# EAGLE design pendulum_connector_board (EAGLE 9.6.2)
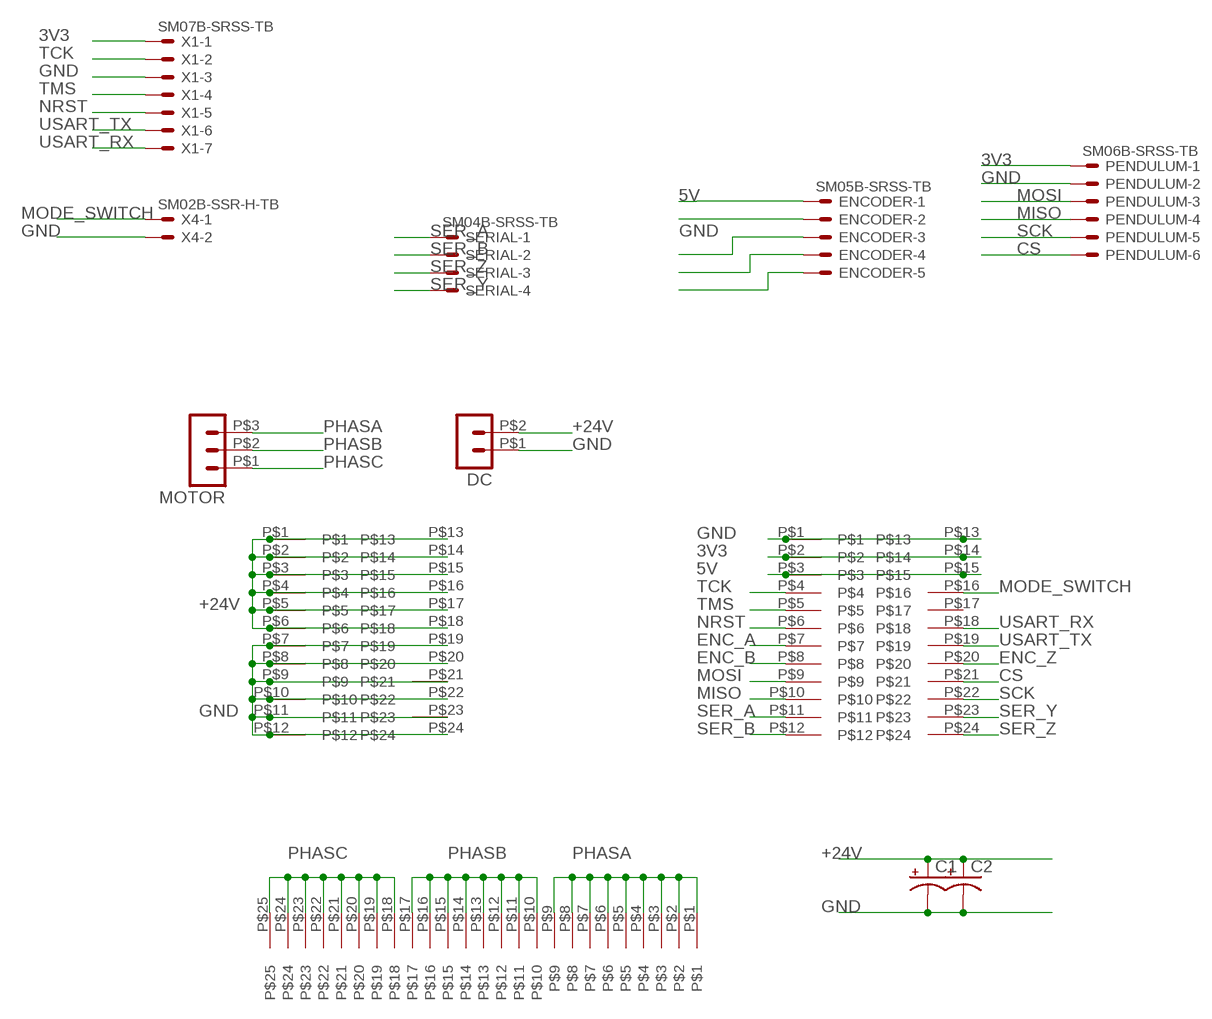
[diagram p0: schematic, sheet 1]

## Parts
C1  CPOL-USE2.5-6  [E2,5-6]
C2  CPOL-USE2.5-6  [E2,5-6]
DC  HEADER_POS2_43650-0200  [43650-0200]
ENCODER  SM05B-SRSS-TB  [SM05B-SRSS-TB]
MOTOR  HEADER_POS3_43650-0300  [43650-0300]
PENDULUM  SM06B-SRSS-TB  [SM06B-SRSS-TB]
SERIAL  SM04B-SRSS-TB  [SM04B-SRSS-TB]
U$2  HEADER_2X12  [2X12X.05]
U$4  HEADER_1X25  [1X25X.05]
U$5  HEADER_2X12  [2X12X.05]
X1  SM07B-SRSS-TB  [SM07B-SRSS-TB]
X4  SM02B-SSR-H-TB  [SM02B-SSR-H-TB]

## Nets
3V3: PENDULUM.1 U$2.P$2 U$2.P$14 X1.1
5V: ENCODER.1 U$2.P$3 U$2.P$15
+24V: C1.+ C2.+ DC.P$2 U$5.P$1 U$5.P$2 U$5.P$3 U$5.P$4 U$5.P$5 U$5.P$6 U$5.P$13 U$5.P$14 U$5.P$15 U$5.P$16 U$5.P$17 U$5.P$18
CS: PENDULUM.6 U$2.P$21
ENC_A: ENCODER.3 U$2.P$7
ENC_B: ENCODER.4 U$2.P$8
ENC_Z: ENCODER.5 U$2.P$20
GND: C1.- C2.- DC.P$1 ENCODER.2 PENDULUM.2 U$2.P$1 U$2.P$13 U$5.P$7 U$5.P$8 U$5.P$9 U$5.P$10 U$5.P$11 U$5.P$12 U$5.P$19 U$5.P$20 U$5.P$21 U$5.P$22 U$5.P$23 U$5.P$24 X1.3 X4.2
MISO: PENDULUM.4 U$2.P$10
MODE_SWITCH: U$2.P$16 X4.1
MOSI: PENDULUM.3 U$2.P$9
NRST: U$2.P$6 X1.5
PHASA: MOTOR.P$3 U$4.P$1 U$4.P$2 U$4.P$3 U$4.P$4 U$4.P$5 U$4.P$6 U$4.P$7 U$4.P$8 U$4.P$9
PHASB: MOTOR.P$2 U$4.P$10 U$4.P$11 U$4.P$12 U$4.P$13 U$4.P$14 U$4.P$15 U$4.P$16 U$4.P$17
PHASC: MOTOR.P$1 U$4.P$18 U$4.P$19 U$4.P$20 U$4.P$21 U$4.P$22 U$4.P$23 U$4.P$24 U$4.P$25
SCK: PENDULUM.5 U$2.P$22
SER_A: SERIAL.1 U$2.P$11
SER_B: SERIAL.2 U$2.P$12
SER_Y: SERIAL.4 U$2.P$23
SER_Z: SERIAL.3 U$2.P$24
TCK: U$2.P$4 X1.2
TMS: U$2.P$5 X1.4
USART_RX: U$2.P$18 X1.7
USART_TX: U$2.P$19 X1.6
Unconnected: U$2.P$17

## Library data of the parts
C1 C2 = rcl:CPOL-US: POLARIZED CAPACITOR, American symbol; SPICEPREFIX: C
DC = con-molex-micro-fit-3_0:HEADER_POS2_?: Molex - Micro-Fit 3.0 Series connector, 3.00mm (0.118") pitch header, 2 positions.
ENCODER = con-jst2:?M05B-SRSS-TB: Disconnectable Crimp style connector, 1.0mm pitch 5 contacts
MOTOR = con-molex-micro-fit-3_0:HEADER_POS3_?: Molex - Micro-Fit 3.0 Series connector, 3.00mm (0.118") pitch header, 3 positions.
PENDULUM = con-jst2:?M06B-SRSS-TB: Disconnectable Crimp style connector, 1.0mm pitch 6 contacts
SERIAL = con-jst2:?M04B-SRSS-TB: Disconnectable Crimp style connector, 1.0mm pitch 4 contacts
U$2 U$5 = Ben_Library:HEADER_2X12
U$4 = Ben_Library:HEADER_1X25
X1 = con-jst2:?M07B-SRSS-TB: Disconnectable Crimp style connector, 1.0mm pitch 7 contacts
X4 = con-jst2:SM02B-SSR-H-TB: Disconnectable Insulation displacement connector, 1.0mm pitch 2 contacts

## Board
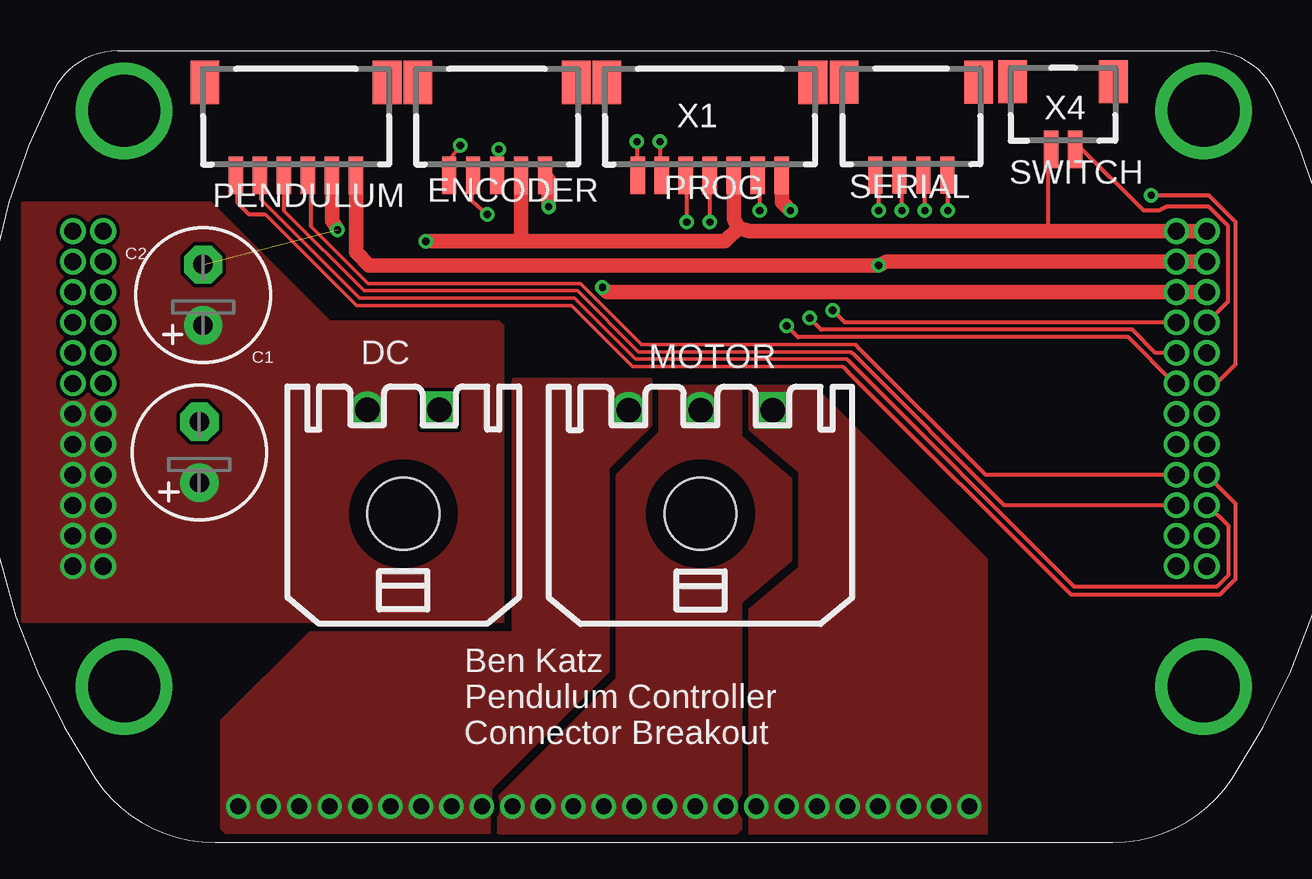
[diagram p1: board, top side]
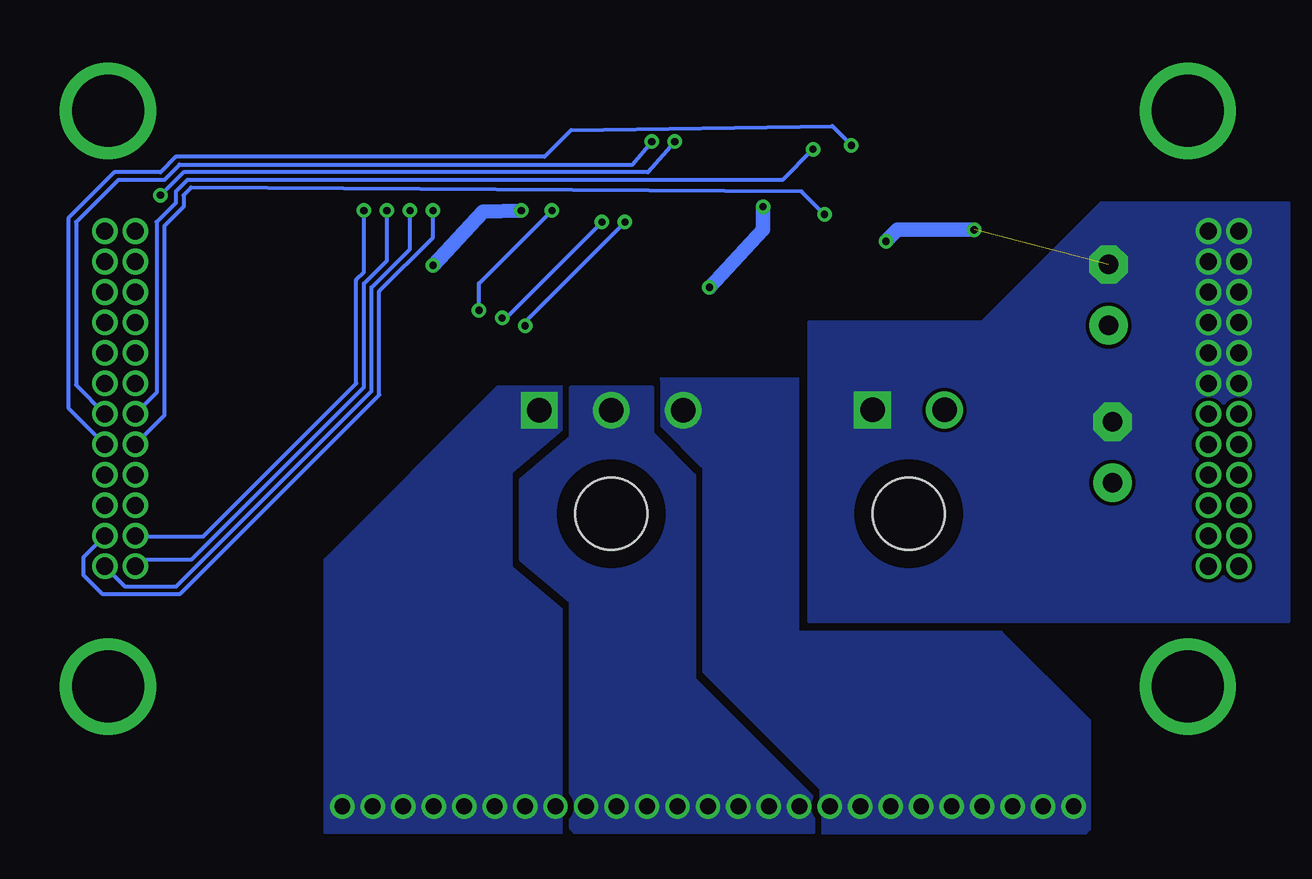
[diagram p2: board, bottom side, seen from below]

No outline drawn. Coordinates in mm, seen from the top.
Copper layers (1*16): Top 0.035mm / dielectric 1.5mm / Bottom 0.035mm
Design rules "default *": minimum track width 6mil, minimum drill 0.3mm, track to track 6mil, track to pad 6mil, pad to pad 6mil, via to via 0.3mm, smd to smd 6mil, copper to edge 30mil, drill to drill 8mil, minimum pad ring 6mil, minimum via ring 6mil, stop-mask expansion 4mil, vias tented up to drill 0mil, thermal gap 10mil

### Footprints (pad centres in the part's own frame; a part is rotated, then mirrored left to right if it is on the bottom)
E2,5-6 = drill 0.813 pad 1.6: + -1.27,0 | drill 0.813 pad 1.6 octagon: - 1.27,0
43650-0200 = drill 1.02 square: P$1 1.5,4.32 | drill 1.02: P$2 -1.5,4.32 | hole 3: 0,0
SM05B-SRSS-TB = smd 0.6 x 1.55: 1 -2,2.975; 2 -1,2.975; 3 0,2.975; 4 1,2.975; 5 2,2.975 | smd 1.2 x 1.8: FIT@1 -3.3,-0.9; FIT@2 3.3,-0.9
43650-0300 = drill 1.02 square: P$1 3,4.32 | drill 1.02: P$2 0,4.32; P$3 -3,4.32 | hole 3: 0,0
SM06B-SRSS-TB = smd 0.6 x 1.55: 1 -2.5,2.975; 2 -1.5,2.975; 3 -0.5,2.975; 4 0.5,2.975; 5 1.5,2.975; 6 2.5,2.975 | smd 1.2 x 1.8: FIT@1 -3.8,-0.9; FIT@2 3.8,-0.9
SM04B-SRSS-TB = smd 0.6 x 1.55: 1 -1.5,2.975; 2 -0.5,2.975; 3 0.5,2.975; 4 1.5,2.975 | smd 1.2 x 1.8: FIT@1 -2.8,-0.9; FIT@2 2.8,-0.9
2X12X.05 = drill 0.711 pad 1.016: P$1 -0.635,6.985; P$2 -0.635,5.715; P$3 -0.635,4.445; P$4 -0.635,3.175; P$5 -0.635,1.905; P$6 -0.635,0.635; P$7 -0.635,-0.635; P$8 -0.635,-1.905; P$9 -0.635,-3.175; P$10 -0.635,-4.445; P$11 -0.635,-5.715; P$12 -0.635,-6.985; P$13 0.635,6.985; P$14 0.635,5.715; P$15 0.635,4.445; P$16 0.635,3.175; P$17 0.635,1.905; P$18 0.635,0.635; P$19 0.635,-0.635; P$20 0.635,-1.905; P$21 0.635,-3.175; P$22 0.635,-4.445; P$23 0.635,-5.715; P$24 0.635,-6.985
1X25X.05 = drill 0.66 pad 1.016: P$1 0,15.24; P$2 0,13.97; P$3 0,12.7; P$4 0,11.43; P$5 0,10.16; P$6 0,8.89; P$7 0,7.62; P$8 0,6.35; P$9 0,5.08; P$10 0,3.81; P$11 0,2.54; P$12 0,1.27; P$13 0,0; P$14 0,-1.27; P$15 0,-2.54; P$16 0,-3.81; P$17 0,-5.08; P$18 0,-6.35; P$19 0,-7.62; P$20 0,-8.89; P$21 0,-10.16; P$22 0,-11.43; P$23 0,-12.7; P$24 0,-13.97; P$25 0,-15.24
SM07B-SRSS-TB = smd 0.6 x 1.55: 1 -3,2.975; 2 -2,2.975; 3 -1,2.975; 4 0,2.975; 5 1,2.975; 6 2,2.975; 7 3,2.975 | smd 1.2 x 1.8: FIT@1 -4.3,-0.9; FIT@2 4.3,-0.9
SM02B-SSR-H-TB = smd 0.6 x 1.55: 1 -0.5,1.925; 2 0.5,1.925 | smd 1.2 x 1.8: FIT@1 -2.1,-0.9; FIT@2 2.1,-0.9

### Placement (x,y rotation side)
C1  -19.2,4.32 90 top
C2  -19.36,-2.24 90 top
DC  -10.86,-4.79 0 top
ENCODER  -6.95,12.28 180 top
MOTOR  1.53,-4.8 0 top
PENDULUM  -15.33,12.28 180 top
SERIAL  10.32,12.29 180 top
U$2  22,0 0 top
U$4  -2.5,-17 90 top
U$5  -24,0 180 top
X1  1.92,12.28 180 top
X4  16.64,12.32 180 top

### Tracks (layer width: path | path; a pad name or v marks a point on that pad's centre or on a via)
3V3  (via drill 0.3)
  Top 0.61: U$2.P$14 U$2.P$2 9.28,5.71 v8.96,5.55 -12.28,5.55 -12.83,6.11 PENDULUM.1 | X1.1 4.92,8.2 v5.28,7.84
  Bottom 0.61: v5.28,7.84 6.88,7.79 v8.96,5.55
5V  (via drill 0.3)
  Top 0.61: U$2.P$15 U$2.P$3 -2.37,4.45 v-2.56,4.64 | v-4.8,8 -4.8,9.13 ENCODER.1
  Bottom 0.61: v-2.56,4.64 -4.8,7.04 v-4.8,8
+24V
  pour Top (rank 2, no thermals): -6.88,3.2 -13.92,3.2 -18.88,8.16 -26.72,8.16 -26.72,-9.28 -6.72,-9.28 -6.72,3.04
CS
  Top 0.152: -16.8,7.68 -16.59,7.68 -12.8,3.89 -3.85,3.89 -1.3,1.34 7.46,1.34 7.68,1.12
  Top 0.16: 7.52,1.28 7.68,1.12 16.96,-8.16 23.2,-8.16 23.84,-7.52 23.84,-4.38 U$2.P$21 | -16.64,7.68 -16.8,7.68 -17.28,7.68 -17.76,8.16 -17.76,9.23 PENDULUM.6
ENC_A  (via drill 0.3)
  Top 0.16: v-6.88,10.4 -6.88,9.39 ENCODER.3
  Bottom 0.16: U$2.P$7 20.48,0.25 20.48,7.36 19.68,8.16 19.68,8.64 19.2,9.12 -5.6,9.12 v-6.88,10.4
ENC_B  (via drill 0.3)
  Top 0.16: v-7.36,7.68 -8,8.23 ENCODER.4
  Bottom 0.16: U$2.P$8 20.16,-0.7 20.16,7.2 19.36,8 19.36,8.48 19.04,8.8 -6.4,8.64 v-7.36,7.68
ENC_Z  (via drill 0.3)
  Top 0.16: v-8.48,10.56 -8.96,9.96 ENCODER.5
  Bottom 0.16: U$2.P$20 24.16,-0.38 24.16,7.52 22.24,9.44 20.32,9.44 19.68,10.08 4.32,10.08 3.2,11.2 -7.68,11.36 v-8.48,10.56
GND  (via drill 0.3)  (1 unrouted)
  Top 0.16: X4.2 16,10.41 16,6.99
  Top 0.61: U$2.P$13 U$2.P$1 16,6.99 3.58,6.99 3.12,7.12 | 3.12,7.12 2.92,7.48 X1.3 | PENDULUM.2 -13.83,7.43 v-13.6,7.04 | v-9.92,6.56 -3.68,6.56 | -3.68,6.56 2.56,6.56 3.12,7.12 | ENCODER.2 -5.95,6.59 -3.68,6.56
  Bottom 0.61: v-13.6,7.04 -10.4,7.04 v-9.92,6.56
  pour Bottom (no thermals): -6.72,3.2 -13.92,3.2 -18.88,8.16 -26.72,8.16 -26.72,-9.28 -6.72,-9.28
MISO
  Top 0.152: -15.84,7.84 -12.49,4.5 -3.6,4.5 -1.05,1.95 7.81,1.95 7.92,1.84
  Top 0.16: U$2.P$10 14.21,-4.45 7.92,1.84 7.84,1.92 | -15.84,7.84 PENDULUM.4
MODE_SWITCH
  Top 0.16: U$2.P$16 23.52,4.06 23.52,7.2 22.72,8 20.96,8 20.64,7.84 20,7.84 17.29,10.55 X4.1
MOSI
  Top 0.152: -14.72,7.2 -12.32,4.8 -3.47,4.8 -0.93,2.25 7.99,2.25 8.08,2.16
  Top 0.16: U$2.P$9 13.41,-3.17 8.08,2.16 8,2.24 | -14.72,7.2 -14.72,9.2 PENDULUM.3
N$1  (via drill 3)
  other vias: -22.5,12
N$2  (via drill 3)
  other vias: 22.5,12
N$3  (via drill 3)
  other vias: 22.5,-12
N$4  (via drill 3)
  other vias: -22.5,-12
NRST  (via drill 0.3)
  Top 0.16: U$2.P$6 21.29,0.64 19.36,2.56 5.6,2.56 v5.12,3.04 | v0.96,7.36 0.96,9.27 X1.5
  Bottom 0.16: v5.12,3.04 5.12,3.2 v0.96,7.36
PHASA
  pour Top (isolate 0.25, rank 2, no thermals): -6.24,0.8 -0.32,0.8 -0.32,-1.44 -2.08,-3.2 -2.08,-11.52 -7.04,-16.48 -7.04,-18.08 -18.24,-18.08 -18.4,-17.92 -18.4,-13.44 -14.72,-9.76 -6.24,-9.76
  pour Bottom (isolate 0.25, rank 2, no thermals): -6.24,0.8 -0.32,0.8 -0.32,-1.44 -2.08,-3.2 -2.08,-11.52 -7.04,-16.48 -7.04,-18.08 -18.24,-18.08 -18.4,-17.92 -18.4,-13.44 -14.72,-9.76 -6.24,-9.76
PHASB
  pour Top (isolate 0.25, no thermals): -0.16,0.48 -0.16,-1.44 -1.92,-3.2 -1.92,-11.68 -6.88,-16.64 -6.88,-18.08 3.04,-18.08 3.2,-17.92 3.2,-8.48 5.28,-6.72 5.28,-3.36 3.2,-1.6 3.2,0.48
  pour Bottom (isolate 0.25, no thermals): -0.16,0.48 -0.16,-1.44 -1.92,-3.2 -1.92,-11.68 -6.88,-16.64 -6.88,-18.08 3.04,-18.08 3.2,-17.92 3.2,-8.48 5.28,-6.72 5.28,-3.36 3.2,-1.6 3.2,0.48
PHASC
  pour Top (isolate 0.25, rank 2, no thermals): 3.36,0.48 3.36,-1.28 5.44,-3.04 5.44,-6.56 3.36,-8.64 3.36,-18.08 13.44,-18.08 13.44,-6.72 6.24,0.48
  pour Bottom (isolate 0.25, rank 2, no thermals): 3.36,0.48 3.36,-1.28 5.44,-3.04 5.44,-6.56 3.36,-8.64 3.36,-18.08 13.44,-18.08 13.44,-6.72 6.24,0.48
SCK
  Top 0.152: -16.8,8.32 -16.32,7.84 -12.67,4.19 -3.73,4.19 -1.18,1.64 7.64,1.64 7.68,1.6
  Top 0.16: U$2.P$22 22.68,-4.45 23.52,-5.28 23.52,-7.36 23.04,-7.84 17.12,-7.84 7.68,1.6 | -16.8,8.32 -16.8,9.28 PENDULUM.5
SER_A  (via drill 0.3)
  Top 0.16: v11.84,7.84 11.84,9.29 SERIAL.1
  Bottom 0.16: U$2.P$11 21.32,-5.76 18.56,-5.76 12.16,0.64 12.16,4.96 11.84,5.28 v11.84,7.84
SER_B  (via drill 0.3)
  Top 0.16: v10.88,7.84 10.88,9.26 SERIAL.2
  Bottom 0.16: U$2.P$12 21.1,-6.72 19.04,-6.72 11.84,0.48 11.84,4.8 10.88,5.76 v10.88,7.84
SER_Y  (via drill 0.3)
  Top 0.16: v8.96,7.84 8.96,9.18 SERIAL.4
  Bottom 0.16: U$2.P$23 23.52,-6.6 23.52,-7.36 22.72,-8.16 19.52,-8.16 11.2,0.16 11.2,4.48 8.96,6.72 v8.96,7.84
SER_Z  (via drill 0.3)
  Top 0.16: v9.92,7.84 9.92,9.21 SERIAL.3
  Bottom 0.16: U$2.P$24 21.78,-7.84 19.68,-7.84 11.52,0.32 11.52,4.64 9.92,6.24 v9.92,7.84
TCK  (via drill 0.3)
  Top 0.16: U$2.P$4 7.54,3.17 v7.04,3.68 | v4,7.84 4,9.22 X1.2
  Bottom 0.16: v7.04,3.68 7.04,4.8 v4,7.84
TMS  (via drill 0.3)
  Top 0.16: U$2.P$5 20.5,1.91 19.52,2.88 6.56,2.88 v6.08,3.36 | v1.92,7.36 X1.4
  Bottom 0.16: v6.08,3.36 5.92,3.36 v1.92,7.36
USART_RX  (via drill 0.3)
  Top 0.16: U$2.P$18 23.04,0.64 23.84,1.44 23.84,7.36 22.72,8.48 v20.32,8.48 | v-1.12,10.72 -1.12,9.59 X1.7
  Bottom 0.16: v20.32,8.48 19.36,9.44 0,9.44 v-1.12,10.72
USART_TX  (via drill 0.3)
  Top 0.16: v-0.16,10.72 -0.16,9.54 X1.6
  Bottom 0.16: U$2.P$19 23.84,0.57 23.84,7.36 22.08,9.12 20.16,9.12 19.52,9.76 0.64,9.76 v-0.16,10.72

### Text on the board
tNames: SWITCH | PROG | DC | MOTOR | Ben Katz / Pendulum Controller / Connector Breakout